# EAGLE schematic musicbox-mechanical-01 (EAGLE 9.6.2)
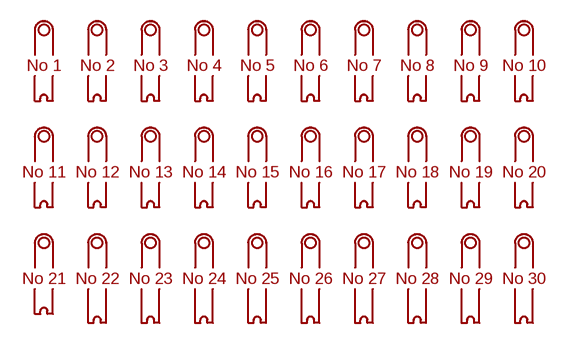
[diagram p0: schematic, sheet 1]

## Parts
U$3  PRONG-01  [PRONG-01]
U$4  PRONG-02  [PRONG-02]
U$5  PRONG-03  [PRONG-03]
U$6  PRONG-04  [PRONG-04]
U$7  PRONG-05  [PRONG-05]
U$8  PRONG-06  [PRONG-06]
U$9  PRONG-07  [PRONG-07]
U$10  PRONG-08  [PRONG-08]
U$11  PRONG-09  [PRONG-09]
U$12  PRONG-10  [PRONG-10]
U$13  PRONG-11  [PRONG-11]
U$14  PRONG-12  [PRONG-12]
U$15  PRONG-13  [PRONG-13]
U$16  PRONG-14  [PRONG-14]
U$17  PRONG-15  [PRONG-15]
U$18  PRONG-16  [PRONG-16]
U$19  PRONG-17  [PRONG-17]
U$20  PRONG-18  [PRONG-18]
U$21  PRONG-19  [PRONG-19]
U$22  PRONG-20  [PRONG-20]
U$23  PRONG-21  [PRONG-21]
U$24  PRONG-22  [PRONG-22]
U$25  PRONG-23  [PRONG-23]
U$26  PRONG-24  [PRONG-24]
U$27  PRONG-25  [PRONG-25]
U$28  PRONG-26  [PRONG-26]
U$29  PRONG-27  [PRONG-27]
U$30  PRONG-28  [PRONG-28]
U$31  PRONG-29  [PRONG-29]
U$32  PRONG-30  [PRONG-30]

## Library data of the parts
U$3 = music-box-parts:PRONG-01
U$4 = music-box-parts:PRONG-02
U$5 = music-box-parts:PRONG-03
U$6 = music-box-parts:PRONG-04
U$7 = music-box-parts:PRONG-05
U$8 = music-box-parts:PRONG-06
U$9 = music-box-parts:PRONG-07
U$10 = music-box-parts:PRONG-08
U$11 = music-box-parts:PRONG-09
U$12 = music-box-parts:PRONG-10
U$13 = music-box-parts:PRONG-11
U$14 = music-box-parts:PRONG-12
U$15 = music-box-parts:PRONG-13
U$16 = music-box-parts:PRONG-14
U$17 = music-box-parts:PRONG-15
U$18 = music-box-parts:PRONG-16
U$19 = music-box-parts:PRONG-17
U$20 = music-box-parts:PRONG-18
U$21 = music-box-parts:PRONG-19
U$22 = music-box-parts:PRONG-20
U$23 = music-box-parts:PRONG-21
U$24 = music-box-parts:PRONG-22
U$25 = music-box-parts:PRONG-23
U$26 = music-box-parts:PRONG-24
U$27 = music-box-parts:PRONG-25
U$28 = music-box-parts:PRONG-26
U$29 = music-box-parts:PRONG-27
U$30 = music-box-parts:PRONG-28
U$31 = music-box-parts:PRONG-29
U$32 = music-box-parts:PRONG-30